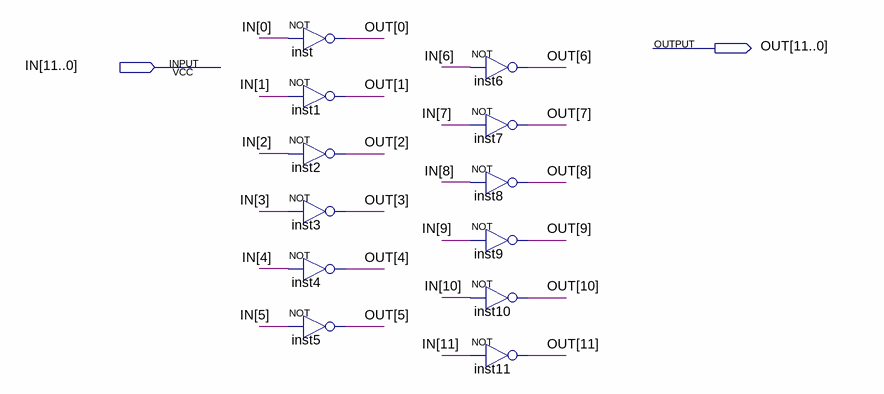
[diagram p0: schematic sheet]
// Quartus schematic NOT12.bdf as structural Verilog: 12 symbols, 2 pins
module NOT12 (
  input  [11:0] IN,
  output [11:0] OUT
);

  not inst (OUT[0], IN[0]);
  not inst1 (OUT[1], IN[1]);
  not inst2 (OUT[2], IN[2]);
  not inst3 (OUT[3], IN[3]);
  not inst4 (OUT[4], IN[4]);
  not inst5 (OUT[5], IN[5]);
  not inst6 (OUT[6], IN[6]);
  not inst7 (OUT[7], IN[7]);
  not inst8 (OUT[8], IN[8]);
  not inst9 (OUT[9], IN[9]);
  not inst10 (OUT[10], IN[10]);
  not inst11 (OUT[11], IN[11]);
endmodule
